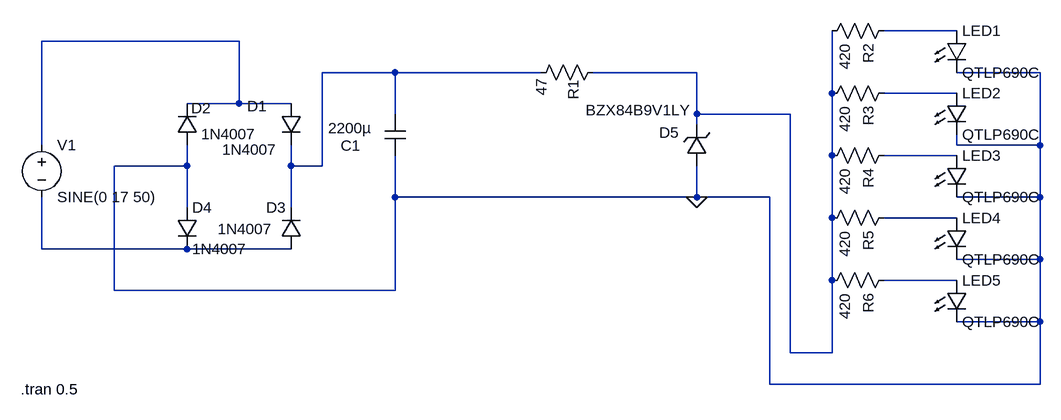
[diagram p0: schematic power_supply_ltspice.asc]
power_supply_ltspice.asc, the LTspice schematic file:
Version 4.1
SHEET 1 1912 960
WIRE 1184 64 1072 64
WIRE 80 80 -224 80
WIRE 320 128 208 128
WIRE 544 128 320 128
WIRE 784 128 624 128
WIRE 1312 128 1184 128
WIRE 992 160 992 64
WIRE 1184 160 1072 160
WIRE 80 176 80 80
WIRE 80 176 0 176
WIRE 160 176 80 176
WIRE 320 192 320 128
WIRE 784 192 784 128
WIRE 928 192 784 192
WIRE 784 208 784 192
WIRE -224 240 -224 80
WIRE 1184 240 1184 224
WIRE 1312 240 1312 128
WIRE 1312 240 1184 240
WIRE 992 256 992 160
WIRE 1184 256 1072 256
WIRE 0 272 0 240
WIRE 0 272 -112 272
WIRE 160 272 160 240
WIRE 208 272 208 128
WIRE 208 272 160 272
WIRE 320 320 320 256
WIRE 784 320 784 272
WIRE 784 320 320 320
WIRE 896 320 784 320
WIRE 1312 320 1312 240
WIRE 1312 320 1184 320
WIRE 0 336 0 272
WIRE 160 336 160 272
WIRE 992 352 992 256
WIRE 1184 352 1072 352
WIRE -224 400 -224 320
WIRE 0 400 -224 400
WIRE 160 400 0 400
WIRE 1312 416 1312 320
WIRE 1312 416 1184 416
WIRE 992 448 992 352
WIRE 1184 448 1072 448
WIRE -112 464 -112 272
WIRE 320 464 320 320
WIRE 320 464 -112 464
WIRE 1312 512 1312 416
WIRE 1312 512 1184 512
WIRE 928 560 928 192
WIRE 992 560 992 448
WIRE 992 560 928 560
WIRE 896 608 896 320
WIRE 1312 608 1312 512
WIRE 1312 608 896 608
FLAG 784 320 0
SYMBOL voltage -224 224 R0
WINDOW 123 0 0 Left 0
WINDOW 39 0 0 Left 0
SYMATTR InstName V1
SYMATTR Value SINE(0 17 50)
SYMBOL diode 144 176 R0
WINDOW 0 -52 4 Left 2
WINDOW 3 -90 71 Left 2
SYMATTR InstName D1
SYMATTR Value 1N4007
SYMBOL diode 16 240 R180
WINDOW 0 -21 57 Left 2
WINDOW 3 -90 17 Left 2
SYMATTR InstName D2
SYMATTR Value 1N4007
SYMBOL diode 176 400 R180
WINDOW 0 24 64 Left 2
WINDOW 3 44 31 Left 2
SYMATTR InstName D3
SYMATTR Value 1N4007
SYMBOL diode -16 336 R0
SYMATTR InstName D4
SYMATTR Value 1N4007
SYMBOL cap 304 192 R0
WINDOW 0 -68 49 Left 2
WINDOW 3 -87 22 Left 2
SYMATTR InstName C1
SYMATTR Value 2200µ
SYMATTR SpiceLine V=25
SYMBOL res 640 112 R90
WINDOW 0 28 46 Left 2
WINDOW 3 25 95 Left 2
SYMATTR InstName R1
SYMATTR Value 47
SYMBOL zener 800 272 R180
WINDOW 3 26 86 Left 2
WINDOW 0 43 51 Left 2
SYMATTR Value BZX84B9V1LY
SYMATTR InstName D5
SYMBOL res 1088 48 R90
SYMATTR InstName R2
SYMATTR Value 420
SYMBOL res 1088 144 R90
SYMATTR InstName R3
SYMATTR Value 420
SYMBOL res 1088 240 R90
SYMATTR InstName R4
SYMATTR Value 420
SYMBOL res 1088 336 R90
SYMATTR InstName R5
SYMATTR Value 420
SYMBOL res 1088 432 R90
SYMATTR InstName R6
SYMATTR Value 420
SYMBOL led 1168 64 R0
SYMATTR InstName LED1
SYMATTR Value QTLP690C
SYMBOL led 1168 160 R0
SYMATTR InstName LED2
SYMATTR Value QTLP690C
SYMBOL led 1168 256 R0
SYMATTR InstName LED3
SYMATTR Value QTLP690C
SYMBOL led 1168 352 R0
SYMATTR InstName LED4
SYMATTR Value QTLP690C
SYMBOL led 1168 448 R0
SYMATTR InstName LED5
SYMATTR Value QTLP690C
TEXT -256 616 Left 2 !.tran 0.5

The netlist it stands for:
* power_supply_ltspice.asc
V1 N002 N008 SINE(0 17 50)
D1 N002 N003 1N4007
D2 0 N002 1N4007
D3 N008 N003 1N4007
D4 0 N008 1N4007
C1 N003 0 2200µ V=25
R1 N004 N003 47
D5 0 N004 BZX84B9V1LY
R2 N001 N004 420
R3 N005 N004 420
R4 N006 N004 420
R5 N007 N004 420
R6 N009 N004 420
D§LED1 N001 0 QTLP690C
D§LED2 N005 0 QTLP690C
D§LED3 N006 0 QTLP690C
D§LED4 N007 0 QTLP690C
D§LED5 N009 0 QTLP690C
.model D D
.lib standard.dio
.tran 0.5
.backanno
.end